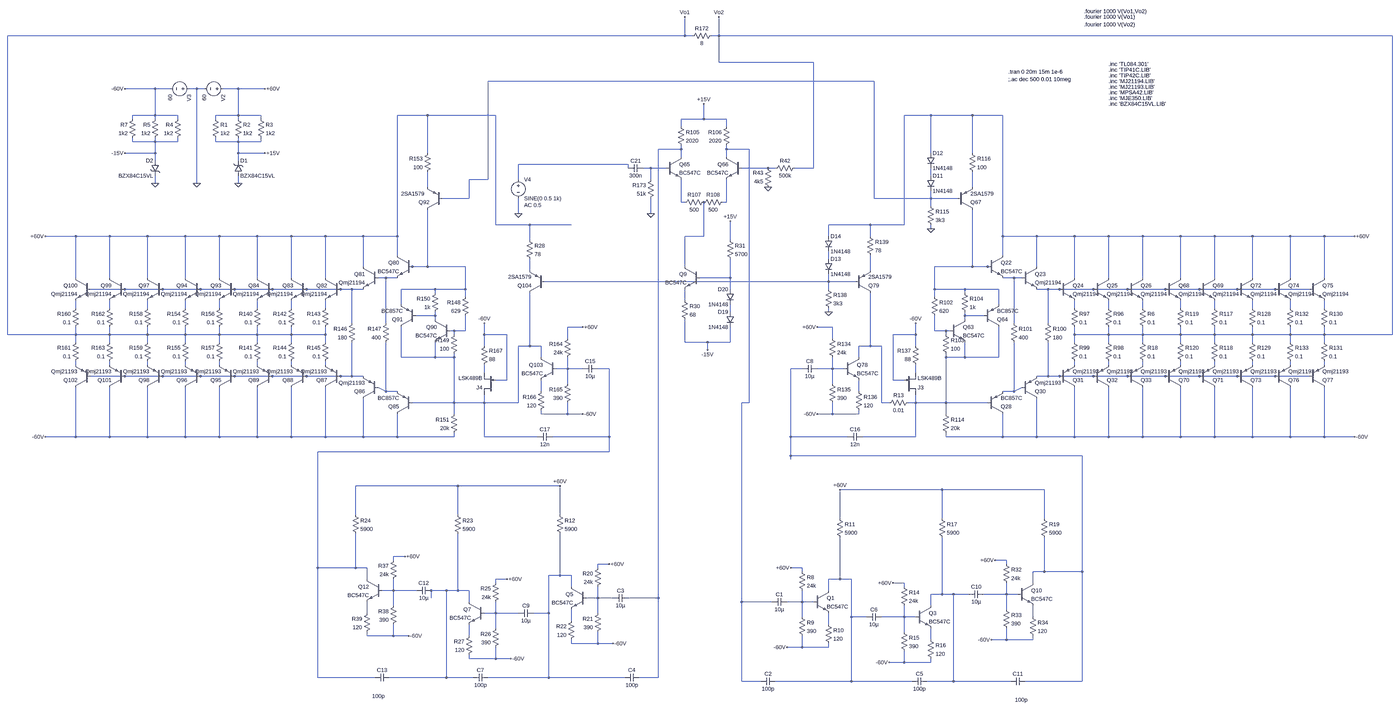
[diagram p0: schematic testV10.asc, whole sheet]
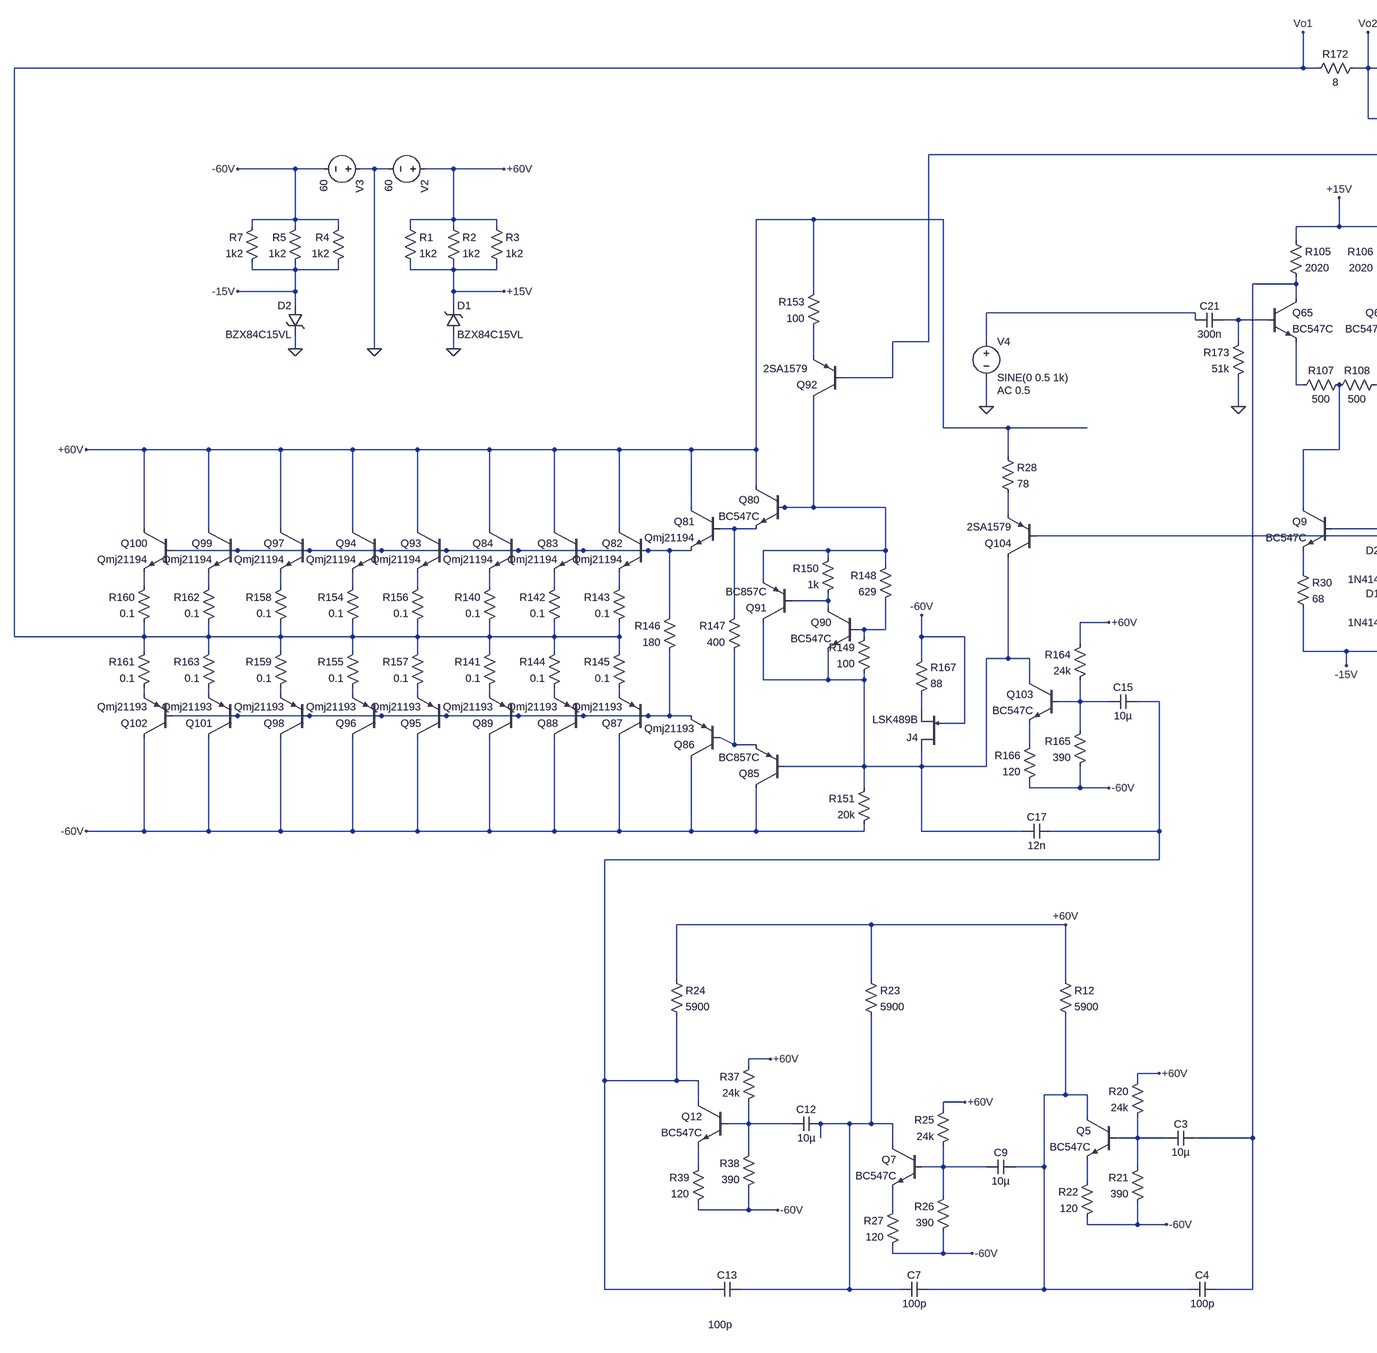
[diagram p1: schematic testV10.asc, part, row 1 of 1, column 1 of 2]
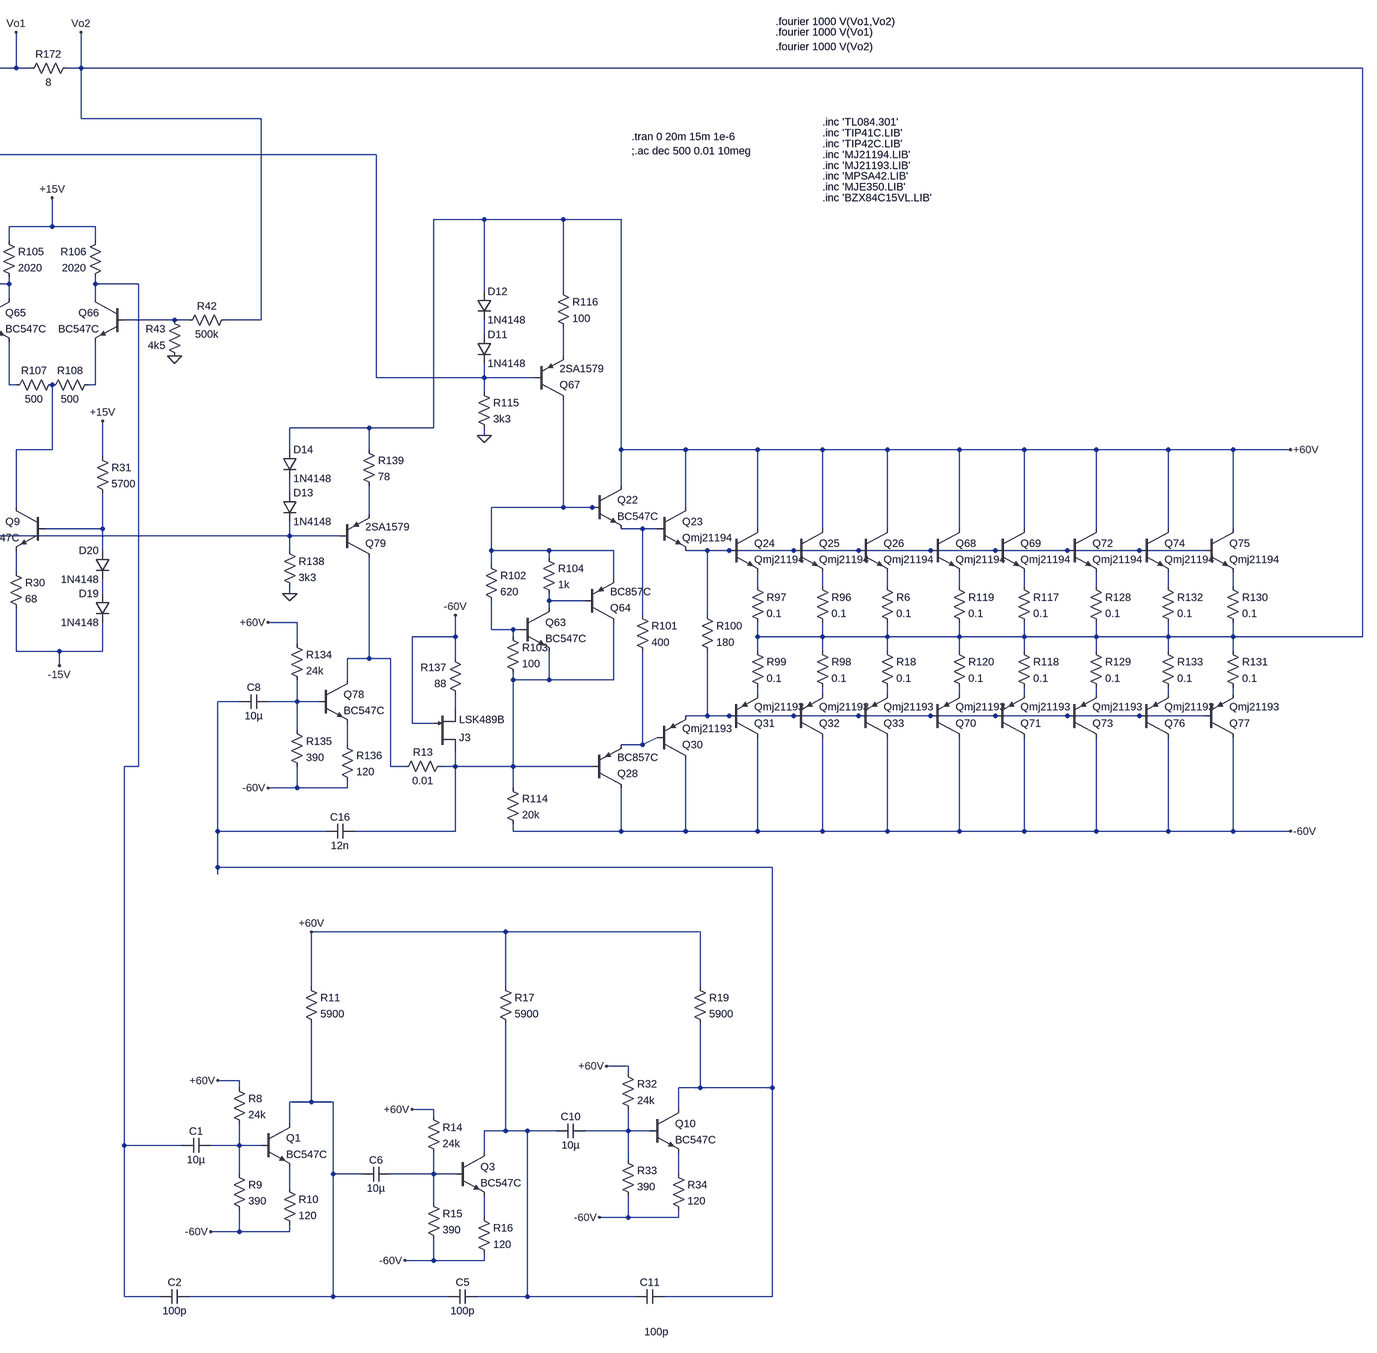
[diagram p2: schematic testV10.asc, part, row 1 of 1, column 2 of 2]
testV10.asc, the LTspice schematic file:
Version 4
SHEET 1 16980 7664
WIRE 7632 4208 7632 4128
WIRE 7632 4208 4768 4208
WIRE 7664 4208 7632 4208
WIRE 7776 4208 7776 4128
WIRE 7776 4208 7744 4208
WIRE 10624 4208 7776 4208
WIRE 7776 4320 7776 4208
WIRE 8176 4320 7776 4320
WIRE 8432 4400 6800 4400
WIRE 5392 4432 5264 4432
WIRE 5456 4432 5392 4432
WIRE 5568 4432 5536 4432
WIRE 5600 4432 5568 4432
WIRE 5744 4432 5680 4432
WIRE 5856 4432 5744 4432
WIRE 5392 4544 5392 4432
WIRE 5392 4544 5296 4544
WIRE 5488 4544 5392 4544
WIRE 5744 4544 5744 4432
WIRE 5744 4544 5648 4544
WIRE 5840 4544 5744 4544
WIRE 6544 4544 6416 4544
WIRE 6832 4544 6544 4544
WIRE 8672 4544 8560 4544
WIRE 8848 4544 8672 4544
WIRE 8976 4544 8848 4544
WIRE 5296 4560 5296 4544
WIRE 5392 4560 5392 4544
WIRE 5488 4560 5488 4544
WIRE 5648 4560 5648 4544
WIRE 5744 4560 5744 4544
WIRE 5840 4560 5840 4544
WIRE 7712 4560 7712 4496
WIRE 7712 4560 7616 4560
WIRE 7808 4560 7712 4560
WIRE 7616 4592 7616 4560
WIRE 7808 4592 7808 4560
WIRE 5296 4656 5296 4640
WIRE 5392 4656 5392 4640
WIRE 5392 4656 5296 4656
WIRE 5488 4656 5488 4640
WIRE 5488 4656 5392 4656
WIRE 5648 4656 5648 4640
WIRE 5744 4656 5744 4640
WIRE 5744 4656 5648 4656
WIRE 5840 4656 5840 4640
WIRE 5840 4656 5744 4656
WIRE 7616 4688 7616 4672
WIRE 7616 4688 7520 4688
WIRE 7808 4688 7808 4672
WIRE 7904 4688 7808 4688
WIRE 5392 4704 5392 4656
WIRE 5392 4704 5264 4704
WIRE 5744 4704 5744 4656
WIRE 5856 4704 5744 4704
WIRE 6544 4704 6544 4544
WIRE 8672 4704 8672 4544
WIRE 8848 4704 8848 4544
WIRE 7616 4720 7616 4688
WIRE 7808 4720 7808 4688
WIRE 5392 4736 5392 4704
WIRE 5744 4736 5744 4704
WIRE 7392 4752 6928 4752
WIRE 7392 4768 7392 4752
WIRE 7488 4768 7456 4768
WIRE 7552 4768 7488 4768
WIRE 7984 4768 7872 4768
WIRE 8016 4768 7984 4768
WIRE 8176 4768 8176 4320
WIRE 8176 4768 8096 4768
WIRE 8672 4800 8672 4768
WIRE 6800 4816 6800 4400
WIRE 6800 4816 6720 4816
WIRE 6928 4816 6928 4752
WIRE 7488 4816 7488 4768
WIRE 5392 4832 5392 4800
WIRE 5568 4832 5568 4432
WIRE 5744 4832 5744 4800
WIRE 6544 4848 6544 4784
WIRE 8848 4848 8848 4784
WIRE 6720 4896 6720 4816
WIRE 6720 4896 6608 4896
WIRE 8432 4896 8432 4400
WIRE 8672 4896 8672 4864
WIRE 8672 4896 8432 4896
WIRE 8784 4896 8672 4896
WIRE 7616 4912 7616 4816
WIRE 7632 4912 7616 4912
WIRE 7808 4912 7808 4816
WIRE 7808 4912 7792 4912
WIRE 8672 4928 8672 4896
WIRE 6928 4960 6928 4896
WIRE 7488 4960 7488 4896
WIRE 6832 5008 6832 4544
WIRE 6976 5008 6832 5008
WIRE 7152 5008 6976 5008
WIRE 8416 5008 8240 5008
WIRE 8560 5008 8560 4544
WIRE 8560 5008 8416 5008
WIRE 8672 5024 8672 5008
WIRE 5056 5056 4928 5056
WIRE 5200 5056 5056 5056
WIRE 5360 5056 5200 5056
WIRE 5520 5056 5360 5056
WIRE 5664 5056 5520 5056
WIRE 5824 5056 5664 5056
WIRE 5968 5056 5824 5056
WIRE 6112 5056 5968 5056
WIRE 6272 5056 6112 5056
WIRE 6416 5056 6416 4544
WIRE 6416 5056 6272 5056
WIRE 7712 5056 7712 4912
WIRE 7712 5056 7632 5056
WIRE 8240 5056 8240 5008
WIRE 8416 5056 8416 5008
WIRE 8976 5056 8976 4544
WIRE 9120 5056 8976 5056
WIRE 9280 5056 9120 5056
WIRE 9424 5056 9280 5056
WIRE 9568 5056 9424 5056
WIRE 9728 5056 9568 5056
WIRE 9872 5056 9728 5056
WIRE 10032 5056 9872 5056
WIRE 10192 5056 10032 5056
WIRE 10336 5056 10192 5056
WIRE 10464 5056 10336 5056
WIRE 6976 5072 6976 5008
WIRE 7824 5072 7824 4992
WIRE 6416 5136 6416 5056
WIRE 8976 5136 8976 5056
WIRE 8240 5152 8240 5120
WIRE 6272 5184 6272 5056
WIRE 6480 5184 6464 5184
WIRE 6544 5184 6544 4944
WIRE 6544 5184 6480 5184
WIRE 6704 5184 6544 5184
WIRE 7632 5184 7632 5056
WIRE 8848 5184 8848 4944
WIRE 8848 5184 8688 5184
WIRE 8912 5184 8848 5184
WIRE 8928 5184 8912 5184
WIRE 9120 5184 9120 5056
WIRE 6976 5200 6976 5152
WIRE 8416 5200 8416 5136
WIRE 5056 5232 5056 5056
WIRE 5200 5232 5200 5056
WIRE 5360 5232 5360 5056
WIRE 5520 5232 5520 5056
WIRE 5664 5232 5664 5056
WIRE 5824 5232 5824 5056
WIRE 5968 5232 5968 5056
WIRE 6112 5232 6112 5056
WIRE 6368 5232 6336 5232
WIRE 6416 5232 6368 5232
WIRE 7824 5232 7824 5152
WIRE 7824 5232 7696 5232
WIRE 9024 5232 8976 5232
WIRE 9056 5232 9024 5232
WIRE 9280 5232 9280 5056
WIRE 9424 5232 9424 5056
WIRE 9568 5232 9568 5056
WIRE 9728 5232 9728 5056
WIRE 9872 5232 9872 5056
WIRE 10032 5232 10032 5056
WIRE 10192 5232 10192 5056
WIRE 10336 5232 10336 5056
WIRE 8240 5248 8240 5216
WIRE 8240 5248 7040 5248
WIRE 8352 5248 8240 5248
WIRE 5264 5280 5120 5280
WIRE 5424 5280 5264 5280
WIRE 5584 5280 5424 5280
WIRE 5728 5280 5584 5280
WIRE 5888 5280 5728 5280
WIRE 6032 5280 5888 5280
WIRE 6176 5280 6032 5280
WIRE 6224 5280 6176 5280
WIRE 6272 5280 6224 5280
WIRE 6576 5280 6432 5280
WIRE 6704 5280 6704 5184
WIRE 6704 5280 6576 5280
WIRE 7824 5280 7824 5232
WIRE 8240 5280 8240 5248
WIRE 8688 5280 8688 5184
WIRE 8816 5280 8688 5280
WIRE 8960 5280 8816 5280
WIRE 9168 5280 9120 5280
WIRE 9216 5280 9168 5280
WIRE 9360 5280 9216 5280
WIRE 9504 5280 9360 5280
WIRE 9664 5280 9504 5280
WIRE 9808 5280 9664 5280
WIRE 9968 5280 9808 5280
WIRE 10128 5280 9968 5280
WIRE 10272 5280 10128 5280
WIRE 6576 5296 6576 5280
WIRE 8816 5296 8816 5280
WIRE 6704 5312 6704 5280
WIRE 8688 5312 8688 5280
WIRE 7632 5328 7632 5280
WIRE 6432 5344 6432 5280
WIRE 8960 5344 8960 5280
WIRE 5056 5360 5056 5328
WIRE 5200 5360 5200 5328
WIRE 5360 5360 5360 5328
WIRE 5520 5360 5520 5328
WIRE 5664 5360 5664 5328
WIRE 5824 5360 5824 5328
WIRE 5968 5360 5968 5328
WIRE 6112 5360 6112 5328
WIRE 9280 5360 9280 5328
WIRE 9424 5360 9424 5328
WIRE 9568 5360 9568 5328
WIRE 9728 5360 9728 5328
WIRE 9872 5360 9872 5328
WIRE 10032 5360 10032 5328
WIRE 10192 5360 10192 5328
WIRE 10336 5360 10336 5328
WIRE 7824 5376 7824 5344
WIRE 8240 5376 8240 5360
WIRE 6576 5392 6576 5376
WIRE 6576 5392 6496 5392
WIRE 8816 5392 8816 5376
WIRE 8896 5392 8816 5392
WIRE 6576 5408 6576 5392
WIRE 8816 5408 8816 5392
WIRE 6224 5424 6224 5280
WIRE 6368 5424 6368 5232
WIRE 9024 5424 9024 5232
WIRE 9168 5424 9168 5280
WIRE 7200 5440 7136 5440
WIRE 8256 5440 8192 5440
WIRE 6656 5456 6640 5456
WIRE 6704 5456 6704 5392
WIRE 6704 5456 6656 5456
WIRE 8688 5456 8688 5392
WIRE 8736 5456 8688 5456
WIRE 8752 5456 8736 5456
WIRE 4768 5472 4768 4208
WIRE 5056 5472 5056 5440
WIRE 5056 5472 4768 5472
WIRE 5200 5472 5200 5440
WIRE 5200 5472 5056 5472
WIRE 5360 5472 5360 5440
WIRE 5360 5472 5200 5472
WIRE 5520 5472 5520 5440
WIRE 5520 5472 5360 5472
WIRE 5664 5472 5664 5440
WIRE 5664 5472 5520 5472
WIRE 5824 5472 5824 5440
WIRE 5824 5472 5664 5472
WIRE 5968 5472 5968 5440
WIRE 5968 5472 5824 5472
WIRE 6112 5472 6112 5440
WIRE 6112 5472 5968 5472
WIRE 6656 5472 6656 5456
WIRE 6784 5472 6784 5424
WIRE 6880 5472 6784 5472
WIRE 8608 5472 8608 5424
WIRE 8608 5472 8512 5472
WIRE 8736 5472 8736 5456
WIRE 9280 5472 9280 5440
WIRE 9424 5472 9424 5440
WIRE 9424 5472 9280 5472
WIRE 9568 5472 9568 5440
WIRE 9568 5472 9424 5472
WIRE 9728 5472 9728 5440
WIRE 9728 5472 9568 5472
WIRE 9872 5472 9872 5440
WIRE 9872 5472 9728 5472
WIRE 10032 5472 10032 5440
WIRE 10032 5472 9872 5472
WIRE 10192 5472 10192 5440
WIRE 10192 5472 10032 5472
WIRE 10336 5472 10336 5440
WIRE 10336 5472 10192 5472
WIRE 10624 5472 10624 4208
WIRE 10624 5472 10336 5472
WIRE 7136 5488 7136 5440
WIRE 8256 5488 8256 5440
WIRE 5056 5504 5056 5472
WIRE 5200 5504 5200 5472
WIRE 5360 5504 5360 5472
WIRE 5520 5504 5520 5472
WIRE 5664 5504 5664 5472
WIRE 5824 5504 5824 5472
WIRE 5968 5504 5968 5472
WIRE 6112 5504 6112 5472
WIRE 7632 5504 7632 5408
WIRE 7728 5504 7632 5504
WIRE 7824 5504 7824 5440
WIRE 7824 5504 7728 5504
WIRE 9280 5504 9280 5472
WIRE 9424 5504 9424 5472
WIRE 9568 5504 9568 5472
WIRE 9728 5504 9728 5472
WIRE 9872 5504 9872 5472
WIRE 10032 5504 10032 5472
WIRE 10192 5504 10192 5472
WIRE 10336 5504 10336 5472
WIRE 6784 5520 6784 5472
WIRE 6976 5520 6976 5296
WIRE 6976 5520 6928 5520
WIRE 7024 5520 6976 5520
WIRE 8416 5520 8416 5296
WIRE 8416 5520 8368 5520
WIRE 8464 5520 8416 5520
WIRE 8608 5520 8608 5472
WIRE 7728 5536 7728 5504
WIRE 6432 5568 6432 5440
WIRE 6576 5568 6576 5504
WIRE 6576 5568 6432 5568
WIRE 6656 5568 6656 5552
WIRE 6656 5568 6576 5568
WIRE 7024 5568 7024 5520
WIRE 8368 5568 8368 5520
WIRE 8736 5568 8736 5552
WIRE 8816 5568 8816 5504
WIRE 8816 5568 8736 5568
WIRE 8960 5568 8960 5440
WIRE 8960 5568 8816 5568
WIRE 5056 5600 5056 5584
WIRE 5200 5600 5200 5584
WIRE 5360 5600 5360 5584
WIRE 5520 5600 5520 5584
WIRE 5664 5600 5664 5584
WIRE 5824 5600 5824 5584
WIRE 5968 5600 5968 5584
WIRE 6112 5600 6112 5584
WIRE 9280 5600 9280 5584
WIRE 9424 5600 9424 5584
WIRE 9568 5600 9568 5584
WIRE 9728 5600 9728 5584
WIRE 9872 5600 9872 5584
WIRE 10032 5600 10032 5584
WIRE 10192 5600 10192 5584
WIRE 10336 5600 10336 5584
WIRE 7136 5616 7136 5568
WIRE 7136 5616 7088 5616
WIRE 7200 5616 7136 5616
WIRE 7312 5616 7264 5616
WIRE 8128 5616 8080 5616
WIRE 8256 5616 8256 5568
WIRE 8256 5616 8192 5616
WIRE 8304 5616 8256 5616
WIRE 6784 5632 6784 5600
WIRE 8608 5632 8608 5600
WIRE 5264 5648 5120 5648
WIRE 5424 5648 5264 5648
WIRE 5584 5648 5424 5648
WIRE 5728 5648 5584 5648
WIRE 5888 5648 5728 5648
WIRE 6032 5648 5888 5648
WIRE 6176 5648 6032 5648
WIRE 6224 5648 6224 5504
WIRE 6224 5648 6176 5648
WIRE 6272 5648 6224 5648
WIRE 9168 5648 9168 5504
WIRE 9168 5648 9120 5648
WIRE 9216 5648 9168 5648
WIRE 9360 5648 9216 5648
WIRE 9504 5648 9360 5648
WIRE 9664 5648 9504 5648
WIRE 9808 5648 9664 5648
WIRE 9968 5648 9808 5648
WIRE 10128 5648 9968 5648
WIRE 10272 5648 10128 5648
WIRE 6880 5664 6880 5472
WIRE 6880 5664 6832 5664
WIRE 8512 5664 8512 5472
WIRE 8560 5664 8512 5664
WIRE 7136 5680 7136 5616
WIRE 8256 5680 8256 5616
WIRE 6368 5712 6368 5504
WIRE 6368 5712 6336 5696
WIRE 6416 5712 6368 5712
WIRE 7024 5712 7024 5664
WIRE 8368 5712 8368 5664
WIRE 9024 5712 9024 5504
WIRE 9024 5712 9056 5696
WIRE 9024 5712 8976 5712
WIRE 6656 5760 6656 5568
WIRE 6656 5760 6480 5760
WIRE 6784 5760 6784 5728
WIRE 6784 5760 6656 5760
WIRE 6928 5760 6928 5520
WIRE 6928 5760 6784 5760
WIRE 7904 5760 7904 4688
WIRE 7904 5760 7872 5760
WIRE 8464 5760 8464 5520
WIRE 8496 5760 8464 5760
WIRE 8608 5760 8608 5728
WIRE 8608 5760 8576 5760
WIRE 8736 5760 8736 5568
WIRE 8736 5760 8608 5760
WIRE 8912 5760 8736 5760
WIRE 6656 5808 6656 5760
WIRE 7024 5808 7024 5792
WIRE 7136 5808 7136 5760
WIRE 7136 5808 7024 5808
WIRE 7200 5808 7136 5808
WIRE 8256 5808 8256 5760
WIRE 8256 5808 8192 5808
WIRE 8368 5808 8368 5792
WIRE 8368 5808 8256 5808
WIRE 8736 5808 8736 5760
WIRE 5056 5904 5056 5696
WIRE 5056 5904 4928 5904
WIRE 5200 5904 5200 5696
WIRE 5200 5904 5056 5904
WIRE 5360 5904 5360 5696
WIRE 5360 5904 5200 5904
WIRE 5520 5904 5520 5696
WIRE 5520 5904 5360 5904
WIRE 5664 5904 5664 5696
WIRE 5664 5904 5520 5904
WIRE 5824 5904 5824 5696
WIRE 5824 5904 5664 5904
WIRE 5968 5904 5968 5696
WIRE 5968 5904 5824 5904
WIRE 6112 5904 6112 5696
WIRE 6112 5904 5968 5904
WIRE 6272 5904 6272 5744
WIRE 6272 5904 6112 5904
WIRE 6416 5904 6416 5808
WIRE 6416 5904 6272 5904
WIRE 6656 5904 6656 5888
WIRE 6656 5904 6416 5904
WIRE 6784 5904 6784 5760
WIRE 7008 5904 6784 5904
WIRE 7312 5904 7312 5616
WIRE 7312 5904 7072 5904
WIRE 8080 5904 8080 5616
WIRE 8320 5904 8080 5904
WIRE 8608 5904 8608 5760
WIRE 8608 5904 8384 5904
WIRE 8736 5904 8736 5888
WIRE 8976 5904 8976 5808
WIRE 8976 5904 8736 5904
WIRE 9120 5904 9120 5744
WIRE 9120 5904 8976 5904
WIRE 9280 5904 9280 5696
WIRE 9280 5904 9120 5904
WIRE 9424 5904 9424 5696
WIRE 9424 5904 9280 5904
WIRE 9568 5904 9568 5696
WIRE 9568 5904 9424 5904
WIRE 9728 5904 9728 5696
WIRE 9728 5904 9568 5904
WIRE 9872 5904 9872 5696
WIRE 9872 5904 9728 5904
WIRE 10032 5904 10032 5696
WIRE 10032 5904 9872 5904
WIRE 10192 5904 10192 5696
WIRE 10192 5904 10032 5904
WIRE 10336 5904 10336 5696
WIRE 10336 5904 10192 5904
WIRE 10464 5904 10336 5904
WIRE 7312 5968 7312 5904
WIRE 7312 5968 6080 5968
WIRE 8080 5984 8080 5904
WIRE 9312 5984 8080 5984
WIRE 8080 6000 8080 5984
WIRE 6672 6112 6240 6112
WIRE 7104 6112 6672 6112
WIRE 8720 6128 8288 6128
WIRE 9152 6128 8720 6128
WIRE 6240 6256 6240 6112
WIRE 6672 6256 6672 6112
WIRE 7104 6256 7104 6112
WIRE 8288 6272 8288 6128
WIRE 8720 6272 8720 6128
WIRE 9152 6272 9152 6128
WIRE 6448 6432 6400 6432
WIRE 6400 6448 6400 6432
WIRE 8992 6448 8944 6448
WIRE 7312 6464 7264 6464
WIRE 8992 6464 8992 6448
WIRE 6080 6480 6080 5968
WIRE 6240 6480 6240 6336
WIRE 6240 6480 6080 6480
WIRE 6288 6480 6240 6480
WIRE 7264 6480 7264 6464
WIRE 8128 6480 8080 6480
WIRE 8128 6496 8128 6480
WIRE 9152 6496 9152 6352
WIRE 9152 6496 9104 6496
WIRE 9312 6496 9312 5984
WIRE 9312 6496 9152 6496
WIRE 7104 6512 7104 6336
WIRE 7104 6512 7056 6512
WIRE 7152 6512 7104 6512
WIRE 6288 6528 6288 6480
WIRE 6880 6528 6832 6528
WIRE 8288 6528 8288 6352
WIRE 8288 6528 8240 6528
WIRE 8336 6528 8288 6528
WIRE 6832 6544 6832 6528
WIRE 8560 6544 8512 6544
WIRE 9104 6544 9104 6496
WIRE 7152 6560 7152 6512
WIRE 8560 6560 8560 6544
WIRE 6400 6576 6400 6528
WIRE 6400 6576 6352 6576
WIRE 6496 6576 6400 6576
WIRE 6624 6576 6560 6576
WIRE 6672 6576 6672 6336
WIRE 6672 6576 6624 6576
WIRE 6720 6576 6672 6576
WIRE 8240 6576 8240 6528
WIRE 8720 6592 8720 6352
WIRE 8720 6592 8672 6592
WIRE 8768 6592 8720 6592
WIRE 8832 6592 8768 6592
WIRE 8992 6592 8992 6544
WIRE 8992 6592 8896 6592
WIRE 9040 6592 8992 6592
WIRE 6560 6608 6560 6576
WIRE 7264 6608 7264 6560
WIRE 7264 6608 7216 6608
WIRE 7328 6608 7264 6608
WIRE 7520 6608 7520 4688
WIRE 7520 6608 7392 6608
WIRE 6720 6624 6720 6576
WIRE 7872 6624 7872 5760
WIRE 8000 6624 7872 6624
WIRE 8128 6624 8128 6576
WIRE 8128 6624 8064 6624
WIRE 8176 6624 8128 6624
WIRE 6400 6640 6400 6576
WIRE 8672 6640 8672 6592
WIRE 8992 6656 8992 6592
WIRE 6288 6672 6288 6624
WIRE 6832 6672 6832 6624
WIRE 6832 6672 6784 6672
WIRE 6928 6672 6832 6672
WIRE 7056 6672 7056 6512
WIRE 7056 6672 6992 6672
WIRE 7264 6672 7264 6608
WIRE 8128 6688 8128 6624
WIRE 8336 6688 8336 6528
WIRE 8400 6688 8336 6688
WIRE 8560 6688 8560 6640
WIRE 8560 6688 8464 6688
WIRE 8608 6688 8560 6688
WIRE 9104 6688 9104 6640
WIRE 7152 6704 7152 6656
WIRE 8240 6720 8240 6672
WIRE 6832 6736 6832 6672
WIRE 8560 6752 8560 6688
WIRE 6288 6768 6288 6752
WIRE 6400 6768 6400 6720
WIRE 6400 6768 6288 6768
WIRE 6464 6768 6400 6768
WIRE 6720 6768 6720 6720
WIRE 8672 6784 8672 6736
WIRE 8992 6784 8992 6736
WIRE 8992 6784 8928 6784
WIRE 9104 6784 9104 6768
WIRE 9104 6784 8992 6784
WIRE 7152 6800 7152 6784
WIRE 7264 6800 7264 6752
WIRE 7264 6800 7152 6800
WIRE 7328 6800 7264 6800
WIRE 8128 6816 8128 6768
WIRE 8128 6816 8064 6816
WIRE 8240 6816 8240 6800
WIRE 8240 6816 8128 6816
WIRE 6720 6864 6720 6848
WIRE 6832 6864 6832 6816
WIRE 6832 6864 6720 6864
WIRE 6896 6864 6832 6864
WIRE 8560 6880 8560 6832
WIRE 8560 6880 8496 6880
WIRE 8672 6880 8672 6864
WIRE 8672 6880 8560 6880
WIRE 6080 6944 6080 6480
WIRE 6320 6944 6080 6944
WIRE 6624 6944 6624 6576
WIRE 6624 6944 6384 6944
WIRE 6736 6944 6624 6944
WIRE 7056 6944 7056 6672
WIRE 7056 6944 6800 6944
WIRE 7376 6944 7056 6944
WIRE 7520 6944 7520 6608
WIRE 7520 6944 7440 6944
WIRE 7872 6960 7872 6624
WIRE 7952 6960 7872 6960
WIRE 8336 6960 8336 6688
WIRE 8336 6960 8016 6960
WIRE 8592 6960 8336 6960
WIRE 8768 6960 8768 6592
WIRE 8768 6960 8656 6960
WIRE 9008 6960 8768 6960
WIRE 9312 6960 9312 6496
WIRE 9312 6960 9072 6960
FLAG 5568 4832 0
FLAG 5856 4432 +60V
FLAG 5264 4432 -60V
FLAG 7712 4496 +15V
FLAG 8672 5024 0
FLAG 8192 5440 +60V
FLAG 8192 5808 -60V
FLAG 8240 5376 0
FLAG 10464 5904 -60V
FLAG 10464 5056 +60V
FLAG 7200 5440 +60V
FLAG 7200 5808 -60V
FLAG 4928 5904 -60V
FLAG 4928 5056 +60V
FLAG 6928 4960 0
FLAG 7488 4960 0
FLAG 8608 5424 -60V
FLAG 6784 5424 -60V
FLAG 5744 4832 0
FLAG 5392 4832 0
FLAG 5856 4704 +15V
FLAG 5264 4704 -15V
FLAG 7632 4128 Vo1
FLAG 7776 4128 Vo2
FLAG 7728 5536 -15V
FLAG 7824 4992 +15V
FLAG 8080 6480 +60V
FLAG 8064 6816 -60V
FLAG 8512 6544 +60V
FLAG 8496 6880 -60V
FLAG 8944 6448 +60V
FLAG 8928 6784 -60V
FLAG 7312 6464 +60V
FLAG 7328 6800 -60V
FLAG 6880 6528 +60V
FLAG 6896 6864 -60V
FLAG 6448 6432 +60V
FLAG 6464 6768 -60V
FLAG 7984 4848 0
FLAG 7104 6112 +60V
FLAG 8288 6128 +60V
SYMBOL voltage 5696 4432 R90
WINDOW 123 0 0 Left 0
WINDOW 39 24 44 Left 2
SYMATTR InstName V2
SYMATTR Value 60
SYMBOL voltage 5552 4432 R90
WINDOW 123 0 0 Left 0
WINDOW 39 24 124 Left 2
SYMATTR InstName V3
SYMATTR Value 60
SYMBOL npn 8912 5136 R0
SYMATTR InstName Q22
SYMATTR Value BC547C
SYMBOL npn 9056 5184 R0
SYMATTR InstName Q23
SYMATTR Value Qmj21194
SYMBOL npn 9216 5232 R0
SYMATTR InstName Q24
SYMATTR Value Qmj21194
SYMBOL npn 9360 5232 R0
SYMATTR InstName Q25
SYMATTR Value Qmj21194
SYMBOL npn 9504 5232 R0
SYMATTR InstName Q26
SYMATTR Value Qmj21194
SYMBOL pnp 8912 5808 M180
SYMATTR InstName Q28
SYMATTR Value BC857C
SYMBOL pnp 9056 5744 M180
SYMATTR InstName Q30
SYMATTR Value Qmj21193
SYMBOL pnp 9216 5696 M180
SYMATTR InstName Q31
SYMATTR Value Qmj21193
SYMBOL pnp 9360 5696 M180
SYMATTR InstName Q32
SYMATTR Value Qmj21193
SYMBOL pnp 9504 5696 M180
SYMATTR InstName Q33
SYMATTR Value Qmj21193
SYMBOL res 9552 5344 R0
SYMATTR InstName R6
SYMATTR Value 0.1
SYMBOL res 9552 5488 R0
SYMATTR InstName R18
SYMATTR Value 0.1
SYMBOL res 9408 5344 R0
SYMATTR InstName R96
SYMATTR Value 0.1
SYMBOL res 9264 5344 R0
SYMATTR InstName R97
SYMATTR Value 0.1
SYMBOL res 9408 5488 R0
SYMATTR InstName R98
SYMATTR Value 0.1
SYMBOL res 9264 5488 R0
SYMATTR InstName R99
SYMATTR Value 0.1
SYMBOL res 9152 5408 R0
SYMATTR InstName R100
SYMATTR Value 180
SYMBOL res 9008 5408 R0
SYMATTR InstName R101
SYMATTR Value 400
SYMBOL npn 8752 5408 R0
SYMATTR InstName Q63
SYMATTR Value BC547C
SYMBOL res 8672 5296 R0
SYMATTR InstName R102
SYMATTR Value 620
SYMBOL res 8720 5456 R0
SYMATTR InstName R103
SYMATTR Value 100
SYMBOL res 8800 5280 R0
SYMATTR InstName R104
SYMATTR Value 1k
SYMBOL pnp 8896 5440 M180
SYMATTR InstName Q64
SYMATTR Value BC857C
SYMBOL npn 7552 4720 R0
SYMATTR InstName Q65
SYMATTR Value BC547C
SYMBOL npn 7872 4720 M0
SYMATTR InstName Q66
SYMATTR Value BC547C
SYMBOL res 7600 4576 R0
SYMATTR InstName R105
SYMATTR Value 2020
SYMBOL res 7824 4576 M0
SYMATTR InstName R106
SYMATTR Value 2020
SYMBOL res 7728 4896 R90
WINDOW 0 0 56 VBottom 2
WINDOW 3 32 56 VTop 2
SYMATTR InstName R107
SYMATTR Value 500
SYMBOL res 7808 4896 R90
WINDOW 0 0 56 VBottom 2
WINDOW 3 32 56 VTop 2
SYMATTR InstName R108
SYMATTR Value 500
SYMBOL res 8720 5792 R0
SYMATTR InstName R114
SYMATTR Value 20k
SYMBOL pnp 8784 4944 M180
SYMATTR InstName Q67
SYMATTR Value 2SA1579
SYMBOL res 8656 4912 R0
SYMATTR InstName R115
SYMATTR Value 3k3
SYMBOL diode 8656 4800 R0
SYMATTR InstName D11
SYMATTR Value 1N4148
SYMBOL diode 8656 4704 R0
SYMATTR InstName D12
SYMATTR Value 1N4148
SYMBOL res 8832 4688 R0
SYMATTR InstName R116
SYMATTR Value 100
SYMBOL npn 9664 5232 R0
SYMATTR InstName Q68
SYMATTR Value Qmj21194
SYMBOL npn 9808 5232 R0
SYMATTR InstName Q69
SYMATTR Value Qmj21194
SYMBOL pnp 9664 5696 M180
SYMATTR InstName Q70
SYMATTR Value Qmj21193
SYMBOL pnp 9808 5696 M180
SYMATTR InstName Q71
SYMATTR Value Qmj21193
SYMBOL res 9856 5344 R0
SYMATTR InstName R117
SYMATTR Value 0.1
SYMBOL res 9856 5488 R0
SYMATTR InstName R118
SYMATTR Value 0.1
SYMBOL res 9712 5344 R0
SYMATTR InstName R119
SYMATTR Value 0.1
SYMBOL res 9712 5488 R0
SYMATTR InstName R120
SYMATTR Value 0.1
SYMBOL npn 9968 5232 R0
SYMATTR InstName Q72
SYMATTR Value Qmj21194
SYMBOL pnp 9968 5696 M180
SYMATTR InstName Q73
SYMATTR Value Qmj21193
SYMBOL res 10016 5344 R0
SYMATTR InstName R128
SYMATTR Value 0.1
SYMBOL res 10016 5488 R0
SYMATTR InstName R129
SYMATTR Value 0.1
SYMBOL npn 10128 5232 R0
SYMATTR InstName Q74
SYMATTR Value Qmj21194
SYMBOL npn 10272 5232 R0
SYMATTR InstName Q75
SYMATTR Value Qmj21194
SYMBOL pnp 10128 5696 M180
SYMATTR InstName Q76
SYMATTR Value Qmj21193
SYMBOL pnp 10272 5696 M180
SYMATTR InstName Q77
SYMATTR Value Qmj21193
SYMBOL res 10320 5344 R0
SYMATTR InstName R130
SYMATTR Value 0.1
SYMBOL res 10320 5488 R0
SYMATTR InstName R131
SYMATTR Value 0.1
SYMBOL res 10176 5344 R0
SYMATTR InstName R132
SYMATTR Value 0.1
SYMBOL res 10176 5488 R0
SYMATTR InstName R133
SYMATTR Value 0.1
SYMBOL cap 8192 5600 R90
WINDOW 0 0 32 VBottom 2
WINDOW 3 32 32 VTop 2
SYMATTR InstName C8
SYMATTR Value 10µ
SYMATTR SpiceLine Rser=0.1
SYMBOL res 8240 5472 R0
SYMATTR InstName R134
SYMATTR Value 24k
SYMBOL res 8240 5664 R0
SYMATTR InstName R135
SYMATTR Value 390
SYMBOL npn 8304 5568 R0
SYMATTR InstName Q78
SYMATTR Value BC547C
SYMBOL res 8352 5696 R0
SYMATTR InstName R136
SYMATTR Value 120
SYMBOL njf 8560 5728 M180
SYMATTR InstName J3
SYMATTR Value LSK489B
SYMBOL res 8624 5616 R180
WINDOW 0 36 76 Left 2
WINDOW 3 36 40 Left 2
SYMATTR InstName R137
SYMATTR Value 88
SYMBOL pnp 8352 5296 M180
SYMATTR InstName Q79
SYMATTR Value 2SA1579
SYMBOL res 8224 5264 R0
SYMATTR InstName R138
SYMATTR Value 3k3
SYMBOL diode 8224 5152 R0
SYMATTR InstName D13
SYMATTR Value 1N4148
SYMBOL diode 8224 5056 R0
SYMATTR InstName D14
SYMATTR Value 1N4148
SYMBOL res 8400 5040 R0
SYMATTR InstName R139
SYMATTR Value 78
SYMBOL cap 8384 5888 R90
WINDOW 0 0 32 VBottom 2
WINDOW 3 32 32 VTop 2
SYMATTR InstName C16
SYMATTR Value 12n
SYMATTR SpiceLine Rser=0.1
SYMBOL npn 6480 5136 M0
SYMATTR InstName Q80
SYMATTR Value BC547C
SYMBOL npn 6336 5184 M0
SYMATTR InstName Q81
SYMATTR Value Qmj21194
SYMBOL npn 6176 5232 M0
SYMATTR InstName Q82
SYMATTR Value Qmj21194
SYMBOL npn 6032 5232 M0
SYMATTR InstName Q83
SYMATTR Value Qmj21194
SYMBOL npn 5888 5232 M0
SYMATTR InstName Q84
SYMATTR Value Qmj21194
SYMBOL pnp 6480 5808 R180
SYMATTR InstName Q85
SYMATTR Value BC857C
SYMBOL pnp 6336 5744 R180
SYMATTR InstName Q86
SYMATTR Value Qmj21193
SYMBOL pnp 6176 5696 R180
SYMATTR InstName Q87
SYMATTR Value Qmj21193
SYMBOL pnp 6032 5696 R180
SYMATTR InstName Q88
SYMATTR Value Qmj21193
SYMBOL pnp 5888 5696 R180
SYMATTR InstName Q89
SYMATTR Value Qmj21193
SYMBOL res 5840 5344 M0
SYMATTR InstName R140
SYMATTR Value 0.1
SYMBOL res 5840 5488 M0
SYMATTR InstName R141
SYMATTR Value 0.1
SYMBOL res 5984 5344 M0
SYMATTR InstName R142
SYMATTR Value 0.1
SYMBOL res 6128 5344 M0
SYMATTR InstName R143
SYMATTR Value 0.1
SYMBOL res 5984 5488 M0
SYMATTR InstName R144
SYMATTR Value 0.1
SYMBOL res 6128 5488 M0
SYMATTR InstName R145
SYMATTR Value 0.1
SYMBOL res 6240 5408 M0
SYMATTR InstName R146
SYMATTR Value 180
SYMBOL res 6384 5408 M0
SYMATTR InstName R147
SYMATTR Value 400
SYMBOL npn 6640 5408 M0
SYMATTR InstName Q90
SYMATTR Value BC547C
SYMBOL res 6720 5296 M0
SYMATTR InstName R148
SYMATTR Value 629
SYMBOL res 6672 5456 M0
SYMATTR InstName R149
SYMATTR Value 100
SYMBOL res 6592 5280 M0
SYMATTR InstName R150
SYMATTR Value 1k
SYMBOL pnp 6496 5440 R180
SYMATTR InstName Q91
SYMATTR Value BC857C
SYMBOL res 6672 5792 M0
SYMATTR InstName R151
SYMATTR Value 20k
SYMBOL pnp 6608 4944 R180
WINDOW 3 77 68 Left 2
SYMATTR Value 2SA1579
SYMATTR InstName Q92
SYMBOL res 6560 4688 M0
SYMATTR InstName R153
SYMATTR Value 100
SYMBOL npn 5728 5232 M0
SYMATTR InstName Q93
SYMATTR Value Qmj21194
SYMBOL npn 5584 5232 M0
SYMATTR InstName Q94
SYMATTR Value Qmj21194
SYMBOL pnp 5728 5696 R180
SYMATTR InstName Q95
SYMATTR Value Qmj21193
SYMBOL pnp 5584 5696 R180
SYMATTR InstName Q96
SYMATTR Value Qmj21193
SYMBOL res 5536 5344 M0
SYMATTR InstName R154
SYMATTR Value 0.1
SYMBOL res 5536 5488 M0
SYMATTR InstName R155
SYMATTR Value 0.1
SYMBOL res 5680 5344 M0
SYMATTR InstName R156
SYMATTR Value 0.1
SYMBOL res 5680 5488 M0
SYMATTR InstName R157
SYMATTR Value 0.1
SYMBOL npn 5424 5232 M0
SYMATTR InstName Q97
SYMATTR Value Qmj21194
SYMBOL pnp 5424 5696 R180
SYMATTR InstName Q98
SYMATTR Value Qmj21193
SYMBOL res 5376 5344 M0
SYMATTR InstName R158
SYMATTR Value 0.1
SYMBOL res 5376 5488 M0
SYMATTR InstName R159
SYMATTR Value 0.1
SYMBOL npn 5264 5232 M0
SYMATTR InstName Q99
SYMATTR Value Qmj21194
SYMBOL npn 5120 5232 M0
SYMATTR InstName Q100
SYMATTR Value Qmj21194
SYMBOL pnp 5264 5696 R180
SYMATTR InstName Q101
SYMATTR Value Qmj21193
SYMBOL pnp 5120 5696 R180
SYMATTR InstName Q102
SYMATTR Value Qmj21193
SYMBOL res 5072 5344 M0
SYMATTR InstName R160
SYMATTR Value 0.1
SYMBOL res 5072 5488 M0
SYMATTR InstName R161
SYMATTR Value 0.1
SYMBOL res 5216 5344 M0
SYMATTR InstName R162
SYMATTR Value 0.1
SYMBOL res 5216 5488 M0
SYMATTR InstName R163
SYMATTR Value 0.1
SYMBOL cap 7200 5600 M90
WINDOW 0 0 32 VBottom 2
WINDOW 3 32 32 VTop 2
SYMATTR InstName C15
SYMATTR Value 10µ
SYMATTR SpiceLine Rser=0.1
SYMBOL res 7152 5472 M0
SYMATTR InstName R164
SYMATTR Value 24k
SYMBOL res 7152 5664 M0
SYMATTR InstName R165
SYMATTR Value 390
SYMBOL npn 7088 5568 M0
SYMATTR InstName Q103
SYMATTR Value BC547C
SYMBOL res 7040 5696 M0
SYMATTR InstName R166
SYMATTR Value 120
SYMBOL njf 6832 5728 R180
SYMATTR InstName J4
SYMATTR Value LSK489B
SYMBOL res 6768 5616 M180
WINDOW 0 36 76 Left 2
WINDOW 3 36 40 Left 2
SYMATTR InstName R167
SYMATTR Value 88
SYMBOL pnp 7040 5296 R180
SYMATTR InstName Q104
SYMATTR Value 2SA1579
SYMBOL cap 7008 5888 M90
WINDOW 0 0 32 VBottom 2
WINDOW 3 32 32 VTop 2
SYMATTR InstName C17
SYMATTR Value 12n
SYMATTR SpiceLine Rser=0.1
SYMBOL voltage 6928 4800 R0
WINDOW 123 24 124 Left 2
WINDOW 39 0 0 Left 0
SYMATTR Value2 AC 0.5
SYMATTR InstName V4
SYMATTR Value SINE(0 0.5 1k)
SYMBOL cap 7456 4752 R90
WINDOW 0 0 32 VBottom 2
WINDOW 3 32 32 VTop 2
SYMATTR InstName C21
SYMATTR Value 300n
SYMATTR SpiceLine Rser=0.1
SYMBOL res 7504 4800 M0
SYMATTR InstName R173
SYMATTR Value 51k
SYMBOL res 7760 4192 R90
WINDOW 0 0 56 VBottom 2
WINDOW 3 32 56 VTop 2
SYMATTR InstName R172
SYMATTR Value 8
SYMBOL res 5632 4544 R0
SYMATTR InstName R1
SYMATTR Value 1k2
SYMBOL res 5728 4544 R0
SYMATTR InstName R2
SYMATTR Value 1k2
SYMBOL res 5824 4544 R0
SYMATTR InstName R3
SYMATTR Value 1k2
SYMBOL res 5504 4544 M0
SYMATTR InstName R4
SYMATTR Value 1k2
SYMBOL res 5408 4544 M0
SYMATTR InstName R5
SYMATTR Value 1k2
SYMBOL res 5312 4544 M0
SYMATTR InstName R7
SYMATTR Value 1k2
SYMBOL zener 5728 4800 M180
WINDOW 0 24 64 Left 2
WINDOW 3 24 0 Left 2
SYMATTR InstName D1
SYMATTR Value BZX84C15VL
SYMBOL zener 5408 4736 M0
SYMATTR InstName D2
SYMATTR Value BZX84C15VL
SYMBOL res 8592 5744 R90
WINDOW 0 0 56 VBottom 2
WINDOW 3 32 56 VTop 2
SYMATTR InstName R13
SYMATTR Value 0.01
SYMBOL diode 7840 5376 M0
SYMATTR InstName D19
SYMATTR Value 1N4148
SYMBOL diode 7840 5280 M0
SYMATTR InstName D20
SYMATTR Value 1N4148
SYMBOL npn 7696 5184 M0
SYMATTR InstName Q9
SYMATTR Value BC547C
SYMBOL res 7616 5312 R0
SYMATTR InstName R30
SYMATTR Value 68
SYMBOL res 7808 5056 R0
SYMATTR InstName R31
SYMATTR Value 5700
SYMBOL res 8112 6480 R0
SYMATTR InstName R8
SYMATTR Value 24k
SYMBOL res 8112 6672 R0
SYMATTR InstName R9
SYMATTR Value 390
SYMBOL npn 8176 6576 R0
SYMATTR InstName Q1
SYMATTR Value BC547C
SYMBOL res 8224 6704 R0
SYMATTR InstName R10
SYMATTR Value 120
SYMBOL cap 8064 6608 R90
WINDOW 0 0 32 VBottom 2
WINDOW 3 32 32 VTop 2
SYMATTR InstName C1
SYMATTR Value 10µ
SYMATTR SpiceLine Rser=0.1
SYMBOL res 8544 6544 R0
SYMATTR InstName R14
SYMATTR Value 24k
SYMBOL res 8544 6736 R0
SYMATTR InstName R15
SYMATTR Value 390
SYMBOL npn 8608 6640 R0
SYMATTR InstName Q3
SYMATTR Value BC547C
SYMBOL res 8656 6768 R0
SYMATTR InstName R16
SYMATTR Value 120
SYMBOL cap 7952 6944 M90
WINDOW 0 0 32 VBottom 2
WINDOW 3 32 32 VTop 2
SYMATTR InstName C2
SYMATTR Value 100p
SYMBOL cap 8592 6944 M90
WINDOW 0 0 32 VBottom 2
WINDOW 3 32 32 VTop 2
SYMATTR InstName C5
SYMATTR Value 100p
SYMBOL cap 8400 6672 M90
WINDOW 0 0 32 VBottom 2
WINDOW 3 32 32 VTop 2
SYMATTR InstName C6
SYMATTR Value 10µ
SYMBOL res 8976 6448 R0
SYMATTR InstName R32
SYMATTR Value 24k
SYMBOL res 8976 6640 R0
SYMATTR InstName R33
SYMATTR Value 390
SYMBOL npn 9040 6544 R0
SYMATTR InstName Q10
SYMATTR Value BC547C
SYMBOL res 9088 6672 R0
SYMATTR InstName R34
SYMATTR Value 120
SYMBOL cap 8832 6576 M90
WINDOW 0 0 32 VBottom 2
WINDOW 3 32 32 VTop 2
SYMATTR InstName C10
SYMATTR Value 10µ
SYMBOL cap 9008 6944 M90
WINDOW 0 0 32 VBottom 2
WINDOW 3 79 47 VTop 2
SYMATTR InstName C11
SYMATTR Value 100p
SYMBOL res 7280 6464 M0
SYMATTR InstName R20
SYMATTR Value 24k
SYMBOL res 7280 6656 M0
SYMATTR InstName R21
SYMATTR Value 390
SYMBOL npn 7216 6560 M0
SYMATTR InstName Q5
SYMATTR Value BC547C
SYMBOL res 7168 6688 M0
SYMATTR InstName R22
SYMATTR Value 120
SYMBOL cap 7328 6592 M90
WINDOW 0 0 32 VBottom 2
WINDOW 3 32 32 VTop 2
SYMATTR InstName C3
SYMATTR Value 10µ
SYMATTR SpiceLine Rser=0.1
SYMBOL res 6848 6528 M0
SYMATTR InstName R25
SYMATTR Value 24k
SYMBOL res 6848 6720 M0
SYMATTR InstName R26
SYMATTR Value 390
SYMBOL npn 6784 6624 M0
SYMATTR InstName Q7
SYMATTR Value BC547C
SYMBOL res 6736 6752 M0
SYMATTR InstName R27
SYMATTR Value 120
SYMBOL cap 7440 6928 R90
WINDOW 0 0 32 VBottom 2
WINDOW 3 32 32 VTop 2
SYMATTR InstName C4
SYMATTR Value 100p
SYMBOL cap 6800 6928 R90
WINDOW 0 0 32 VBottom 2
WINDOW 3 32 32 VTop 2
SYMATTR InstName C7
SYMATTR Value 100p
SYMBOL cap 6992 6656 R90
WINDOW 0 0 32 VBottom 2
WINDOW 3 32 32 VTop 2
SYMATTR InstName C9
SYMATTR Value 10µ
SYMBOL res 6416 6432 M0
SYMATTR InstName R37
SYMATTR Value 24k
SYMBOL res 6416 6624 M0
SYMATTR InstName R38
SYMATTR Value 390
SYMBOL npn 6352 6528 M0
SYMATTR InstName Q12
SYMATTR Value BC547C
SYMBOL res 6304 6656 M0
SYMATTR InstName R39
SYMATTR Value 120
SYMBOL cap 6560 6560 R90
WINDOW 0 0 32 VBottom 2
WINDOW 3 32 32 VTop 2
SYMATTR InstName C12
SYMATTR Value 10µ
SYMBOL cap 6384 6928 R90
WINDOW 0 0 32 VBottom 2
WINDOW 3 79 47 VTop 2
SYMATTR InstName C13
SYMATTR Value 100p
SYMBOL res 8112 4752 R90
WINDOW 0 0 56 VBottom 2
WINDOW 3 32 56 VTop 2
SYMATTR InstName R42
SYMATTR Value 500k
SYMBOL res 8000 4864 R180
WINDOW 0 36 76 Left 2
WINDOW 3 36 40 Left 2
SYMATTR InstName R43
SYMATTR Value 4k5
SYMBOL res 8272 6256 R0
SYMATTR InstName R11
SYMATTR Value 5900
SYMBOL res 7088 6240 R0
SYMATTR InstName R12
SYMATTR Value 5900
SYMBOL res 8704 6256 R0
SYMATTR InstName R17
SYMATTR Value 5900
SYMBOL res 9136 6256 R0
SYMATTR InstName R19
SYMATTR Value 5900
SYMBOL res 6656 6240 R0
SYMATTR InstName R23
SYMATTR Value 5900
SYMBOL res 6224 6240 R0
SYMATTR InstName R24
SYMATTR Value 5900
SYMBOL res 6960 5056 R0
SYMATTR InstName R28
SYMATTR Value 78
TEXT 9424 4328 Left 2 !.inc 'TL084.301'
TEXT 9424 4352 Left 2 !.inc 'TIP41C.LIB'
TEXT 9424 4376 Left 2 !.inc 'TIP42C.LIB'
TEXT 9424 4400 Left 2 !.inc 'MJ21194.LIB'
TEXT 9424 4424 Left 2 !.inc 'MJ21193.LIB'
TEXT 9424 4448 Left 2 !.inc 'MPSA42.LIB'
TEXT 9424 4472 Left 2 !.inc 'MJE350.LIB'
TEXT 9424 4496 Left 2 !.inc 'BZX84C15VL.LIB'
TEXT 9000 4360 Left 2 !.tran 0 20m 15m 1e-6
TEXT 9000 4392 Left 2 !;.ac dec 500 0.01 10meg
TEXT 9320 4104 Left 2 !.fourier 1000 V(Vo1,Vo2)
TEXT 9320 4128 Left 2 !.fourier 1000 V(Vo1)
TEXT 9320 4160 Left 2 !.fourier 1000 V(Vo2)

The netlist it stands for:
* testV10.asc
V2 +60V 0 60
V3 0 -60V 60
Q22 +60V N015 N020 0 BC547C
Q23 +60V N020 N023 0 Qmj21194
Q24 +60V N023 N033 0 Qmj21194
Q25 +60V N023 N034 0 Qmj21194
Q26 +60V N023 N035 0 Qmj21194
Q28 -60V N048 N076 0 BC857C
Q30 -60V N076 N072 0 Qmj21193
Q31 -60V N072 N057 0 Qmj21193
Q32 -60V N072 N058 0 Qmj21193
Q33 -60V N072 N059 0 Qmj21193
R6 N035 Vo2 0.1
R18 Vo2 N059 0.1
R96 N034 Vo2 0.1
R97 N033 Vo2 0.1
R98 Vo2 N058 0.1
R99 Vo2 N057 0.1
R100 N023 N072 180
R101 N020 N076 400
Q63 N043 N045 N048 0 BC547C
R102 N015 N045 620
R103 N045 N048 100
R104 N015 N043 1k
Q64 N048 N043 N015 0 BC857C
Q65 N002 N005 N010 0 BC547C
Q66 N003 N006 N011 0 BC547C
R105 +15V N002 2020
R106 +15V N003 2020
R107 N012 N010 500
R108 N011 N012 500
R114 N048 -60V 20k
Q67 N015 N001 N009 0 2SA1579
R115 N001 0 3k3
D11 N007 N001 1N4148
D12 +60V N007 1N4148
R116 +60V N009 100
Q68 +60V N023 N036 0 Qmj21194
Q69 +60V N023 N037 0 Qmj21194
Q70 -60V N072 N060 0 Qmj21193
Q71 -60V N072 N061 0 Qmj21193
R117 N037 Vo2 0.1
R118 Vo2 N061 0.1
R119 N036 Vo2 0.1
R120 Vo2 N060 0.1
Q72 +60V N023 N038 0 Qmj21194
Q73 -60V N072 N062 0 Qmj21193
R128 N038 Vo2 0.1
R129 Vo2 N062 0.1
Q74 +60V N023 N039 0 Qmj21194
Q75 +60V N023 N040 0 Qmj21194
Q76 -60V N072 N063 0 Qmj21193
Q77 -60V N072 N064 0 Qmj21193
R130 N040 Vo2 0.1
R131 Vo2 N064 0.1
R132 N039 Vo2 0.1
R133 Vo2 N063 0.1
C8 N068 N067 10µ Rser=0.1
R134 +60V N068 24k
R135 N068 -60V 390
Q78 N047 N068 N075 0 BC547C
R136 N075 -60V 120
J3 N048 -60V N070 LSK489B
R137 N070 -60V 88
Q79 N047 N021 N017 0 2SA1579
R138 N021 0 3k3
D13 N013 N021 1N4148
D14 +60V N013 1N4148
R139 +60V N017 78
C16 N048 N067 12n Rser=0.1
Q80 +60V N014 N018 0 BC547C
Q81 +60V N018 N022 0 Qmj21194
Q82 +60V N022 N032 0 Qmj21194
Q83 +60V N022 N031 0 Qmj21194
Q84 +60V N022 N030 0 Qmj21194
Q85 -60V N046 N073 0 BC857C
Q86 -60V N073 N071 0 Qmj21193
Q87 -60V N071 N056 0 Qmj21193
Q88 -60V N071 N055 0 Qmj21193
Q89 -60V N071 N054 0 Qmj21193
R140 N030 Vo1 0.1
R141 Vo1 N054 0.1
R142 N031 Vo1 0.1
R143 N032 Vo1 0.1
R144 Vo1 N055 0.1
R145 Vo1 N056 0.1
R146 N022 N071 180
R147 N018 N073 400
Q90 N042 N044 N046 0 BC547C
R148 N014 N044 629
R149 N044 N046 100
R150 N014 N042 1k
Q91 N046 N042 N014 0 BC857C
R151 N046 -60V 20k
Q92 N014 N001 N008 0 2SA1579
R153 +60V N008 100
Q93 +60V N022 N029 0 Qmj21194
Q94 +60V N022 N028 0 Qmj21194
Q95 -60V N071 N053 0 Qmj21193
Q96 -60V N071 N052 0 Qmj21193
R154 N028 Vo1 0.1
R155 Vo1 N052 0.1
R156 N029 Vo1 0.1
R157 Vo1 N053 0.1
Q97 +60V N022 N027 0 Qmj21194
Q98 -60V N071 N051 0 Qmj21193
R158 N027 Vo1 0.1
R159 Vo1 N051 0.1
Q99 +60V N022 N026 0 Qmj21194
Q100 +60V N022 N025 0 Qmj21194
Q101 -60V N071 N050 0 Qmj21193
Q102 -60V N071 N049 0 Qmj21193
R160 N025 Vo1 0.1
R161 Vo1 N049 0.1
R162 N026 Vo1 0.1
R163 Vo1 N050 0.1
C15 N065 N066 10µ Rser=0.1
R164 +60V N065 24k
R165 N065 -60V 390
Q103 N046 N065 N074 0 BC547C
R166 N074 -60V 120
J4 N046 -60V N069 LSK489B
R167 N069 -60V 88
Q104 N046 N021 N016 0 2SA1579
C17 N046 N066 12n Rser=0.1
V4 N004 0 SINE(0 0.5 1k) AC 0.5
C21 N005 N004 300n Rser=0.1
R173 N005 0 51k
R172 Vo2 Vo1 8
R1 +60V +15V 1k2
R2 +60V +15V 1k2
R3 +60V +15V 1k2
R4 -60V -15V 1k2
R5 -60V -15V 1k2
R7 -60V -15V 1k2
D1 0 +15V BZX84C15VL
D2 -15V 0 BZX84C15VL
R13 N048 N047 0.01
D19 N041 -15V 1N4148
D20 N019 N041 1N4148
Q9 N012 N019 N024 0 BC547C
R30 N024 -15V 68
R31 +15V N019 5700
R8 +60V N084 24k
R9 N084 -60V 390
Q1 N078 N084 N090 0 BC547C
R10 N090 -60V 120
C1 N084 N003 10µ Rser=0.1
R14 +60V N087 24k
R15 N087 -60V 390
Q3 N081 N087 N092 0 BC547C
R16 N092 -60V 120
C2 N003 N078 100p
C5 N078 N081 100p
C6 N078 N087 10µ
R32 +60V N082 24k
R33 N082 -60V 390
Q10 N067 N082 N088 0 BC547C
R34 N088 -60V 120
C10 N081 N082 10µ
C11 N081 N067 100p
R20 +60V N083 24k
R21 N083 -60V 390
Q5 N077 N083 N089 0 BC547C
R22 N089 -60V 120
C3 N083 N002 10µ Rser=0.1
R25 +60V N086 24k
R26 N086 -60V 390
Q7 N080 N086 N091 0 BC547C
R27 N091 -60V 120
C4 N002 N077 100p
C7 N077 N080 100p
C9 N077 N086 10µ
R37 +60V N079 24k
R38 N079 -60V 390
Q12 N066 N079 N085 0 BC547C
R39 N085 -60V 120
C12 N080 N079 10µ
C13 N080 N066 100p
R42 Vo2 N006 500k
R43 0 N006 4k5
R11 +60V N078 5900
R12 +60V N077 5900
R17 +60V N081 5900
R19 +60V N067 5900
R23 +60V N080 5900
R24 +60V N066 5900
R28 +60V N016 78
.model D D
.lib standard.dio
.model NPN NPN
.model PNP PNP
.lib standard.bjt
.model NJF NJF
.model PJF PJF
.lib standard.jft
.inc 'TL084.301'
.inc 'TIP41C.LIB'
.inc 'TIP42C.LIB'
.inc 'MJ21194.LIB'
.inc 'MJ21193.LIB'
.inc 'MPSA42.LIB'
.inc 'MJE350.LIB'
.inc 'BZX84C15VL.LIB'
.tran 0 20m 15m 1e-6
;.ac dec 500 0.01 10meg
.fourier 1000 V(Vo1,Vo2)
.fourier 1000 V(Vo1)
.fourier 1000 V(Vo2)
.backanno
.end